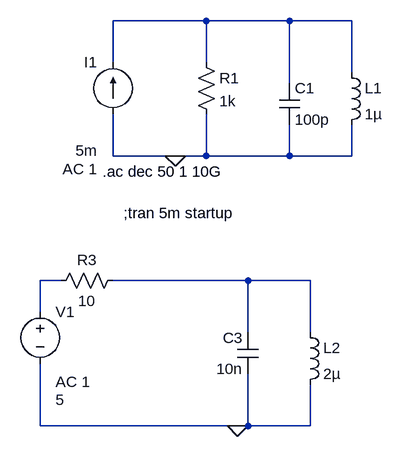
[diagram p0: schematic realim-basecomun.asc]
realim-basecomun.asc, the LTspice schematic file:
Version 4
SHEET 1 880 724
WIRE 208 80 64 80
WIRE 336 80 208 80
WIRE 432 80 336 80
WIRE 64 144 64 80
WIRE 208 144 208 80
WIRE 432 160 432 80
WIRE 336 176 336 80
WIRE 64 288 64 224
WIRE 160 288 64 288
WIRE 208 288 208 224
WIRE 208 288 160 288
WIRE 336 288 336 240
WIRE 336 288 208 288
WIRE 432 288 432 240
WIRE 432 288 336 288
WIRE -16 480 -48 480
WIRE 272 480 64 480
WIRE 368 480 272 480
WIRE -48 528 -48 480
WIRE 272 560 272 480
WIRE 368 560 368 480
WIRE -48 704 -48 608
WIRE 256 704 -48 704
WIRE 272 704 272 624
WIRE 272 704 256 704
WIRE 368 704 368 640
WIRE 368 704 272 704
FLAG 160 288 0
FLAG 256 704 0
SYMBOL cap 320 176 R0
SYMATTR InstName C1
SYMATTR Value 100p
SYMBOL ind 416 144 R0
SYMATTR InstName L1
SYMATTR Value 1µ
SYMBOL current 64 224 R180
WINDOW 0 24 80 Left 2
WINDOW 3 24 -56 Left 2
WINDOW 123 24 -84 Left 2
WINDOW 39 0 0 Left 0
SYMATTR InstName I1
SYMATTR Value 5m
SYMATTR Value2 AC 1
SYMBOL res 192 128 R0
SYMATTR InstName R1
SYMATTR Value 1k
SYMBOL voltage -48 512 R0
WINDOW 3 24 152 Left 2
WINDOW 123 24 124 Left 2
WINDOW 39 0 0 Left 0
SYMATTR Value 5
SYMATTR Value2 AC 1
SYMATTR InstName V1
SYMBOL cap 288 624 R180
WINDOW 0 24 56 Left 2
WINDOW 3 24 8 Left 2
SYMATTR InstName C3
SYMATTR Value 10n
SYMBOL res 80 464 R90
WINDOW 0 0 56 VBottom 2
WINDOW 3 32 56 VTop 2
SYMATTR InstName R3
SYMATTR Value 10
SYMBOL ind 352 544 R0
SYMATTR InstName L2
SYMATTR Value 2µ
TEXT 48 312 Left 2 !.ac dec 50 1 10G
TEXT 80 376 Left 2 !;tran 5m startup

The netlist it stands for:
* realim-basecomun.asc
C1 N001 0 100p
L1 N001 0 1µ
I1 0 N001 5m AC 1
R1 N001 0 1k
V1 N002 0 5 AC 1
C3 0 N003 10n
R3 N003 N002 10
L2 N003 0 2µ
.ac dec 50 1 10G
;tran 5m startup
.backanno
.end